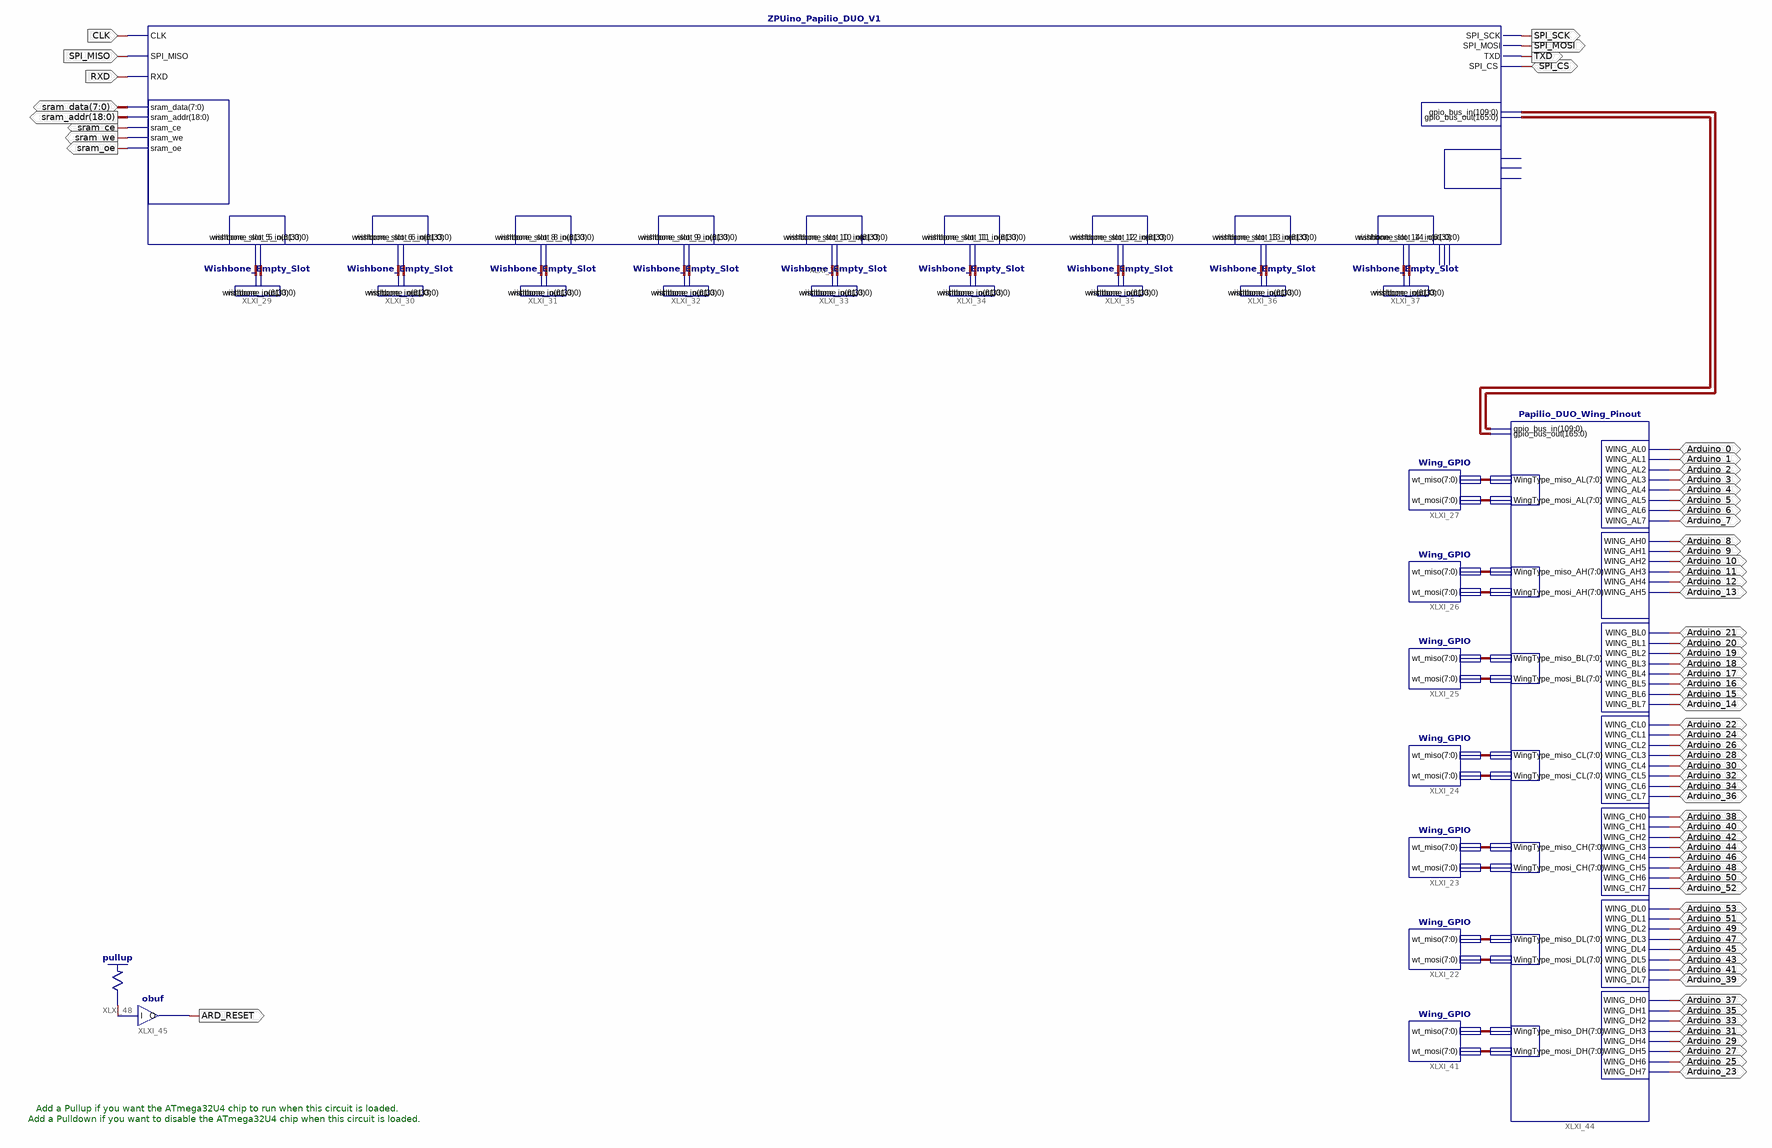
[diagram p0: schematic sheet 1]
// Xilinx ISE schematic Papilio_DUO_LX9.sch (spartan6) as structural Verilog: 20 symbols, 67 ports
module Papilio_DUO_LX9 (
  input  RXD,
  input  SPI_MISO,
  input  CLK,
  inout  Arduino_0,
  inout  Arduino_1,
  inout  Arduino_2,
  inout  Arduino_3,
  inout  Arduino_4,
  inout  Arduino_5,
  inout  Arduino_6,
  inout  Arduino_7,
  inout  Arduino_8,
  inout  Arduino_9,
  inout  Arduino_10,
  inout  Arduino_11,
  inout  Arduino_12,
  inout  Arduino_13,
  inout  Arduino_21,
  inout  Arduino_20,
  inout  Arduino_19,
  inout  Arduino_18,
  inout  Arduino_17,
  inout  Arduino_16,
  inout  Arduino_15,
  inout  Arduino_14,
  inout  SPI_CS,
  inout  [7:0] sram_data,
  inout  Arduino_22,
  inout  Arduino_24,
  inout  Arduino_26,
  inout  Arduino_28,
  inout  Arduino_30,
  inout  Arduino_32,
  inout  Arduino_34,
  inout  Arduino_36,
  inout  Arduino_38,
  inout  Arduino_40,
  inout  Arduino_42,
  inout  Arduino_44,
  inout  Arduino_46,
  inout  Arduino_48,
  inout  Arduino_50,
  inout  Arduino_52,
  inout  Arduino_39,
  inout  Arduino_41,
  inout  Arduino_43,
  inout  Arduino_45,
  inout  Arduino_47,
  inout  Arduino_49,
  inout  Arduino_51,
  inout  Arduino_53,
  inout  Arduino_37,
  inout  Arduino_35,
  inout  Arduino_33,
  inout  Arduino_31,
  inout  Arduino_29,
  inout  Arduino_27,
  inout  Arduino_25,
  inout  Arduino_23,
  output TXD,
  output SPI_MOSI,
  output SPI_SCK,
  output sram_ce,
  output sram_we,
  output sram_oe,
  output [18:0] sram_addr,
  output ARD_RESET
);

  wire XLXN_457;
  wire [7:0] XLXN_325, XLXN_326, XLXN_327, XLXN_328, XLXN_329, XLXN_330, XLXN_331, XLXN_332, XLXN_333,
       XLXN_334, XLXN_335, XLXN_336, XLXN_448, XLXN_449;
  wire [33:0] XLXN_431, XLXN_433, XLXN_435, XLXN_437, XLXN_439, XLXN_441, XLXN_443, XLXN_445, XLXN_447;
  wire [61:0] XLXN_430, XLXN_432, XLXN_434, XLXN_436, XLXN_438, XLXN_440, XLXN_442, XLXN_444, XLXN_446;
  wire [109:0] XLXN_409;
  wire [165:0] XLXN_408;

  Wishbone_Empty_Slot XLXI_37 (.wishbone_in(XLXN_430), .wishbone_out(XLXN_431));
  Wishbone_Empty_Slot XLXI_36 (.wishbone_in(XLXN_432), .wishbone_out(XLXN_433));
  Wishbone_Empty_Slot XLXI_35 (.wishbone_in(XLXN_434), .wishbone_out(XLXN_435));
  Wishbone_Empty_Slot XLXI_34 (.wishbone_in(XLXN_436), .wishbone_out(XLXN_437));
  Wishbone_Empty_Slot XLXI_33 (.wishbone_in(XLXN_438), .wishbone_out(XLXN_439));
  Wishbone_Empty_Slot XLXI_32 (.wishbone_in(XLXN_440), .wishbone_out(XLXN_441));
  Wishbone_Empty_Slot XLXI_31 (.wishbone_in(XLXN_442), .wishbone_out(XLXN_443));
  Wishbone_Empty_Slot XLXI_30 (.wishbone_in(XLXN_444), .wishbone_out(XLXN_445));
  Wishbone_Empty_Slot XLXI_29 (.wishbone_in(XLXN_446), .wishbone_out(XLXN_447));
  Wing_GPIO XLXI_27 (.wt_miso(XLXN_335), .wt_mosi(XLXN_336));
  Wing_GPIO XLXI_26 (.wt_miso(XLXN_333), .wt_mosi(XLXN_334));
  Wing_GPIO XLXI_25 (.wt_miso(XLXN_331), .wt_mosi(XLXN_332));
  Wing_GPIO XLXI_24 (.wt_miso(XLXN_329), .wt_mosi(XLXN_330));
  Wing_GPIO XLXI_23 (.wt_miso(XLXN_327), .wt_mosi(XLXN_328));
  Wing_GPIO XLXI_22 (.wt_miso(XLXN_325), .wt_mosi(XLXN_326));
  ZPUino_Papilio_DUO_V1 XLXI_39 (
    .gpio_bus_out(XLXN_408), .gpio_bus_in(XLXN_409), .SPI_CS(SPI_CS), .TXD(TXD), .SPI_MOSI(SPI_MOSI),
    .SPI_SCK(SPI_SCK), .sram_data(sram_data), .sram_ce(sram_ce), .sram_we(sram_we), .sram_oe(sram_oe),
    .CLK(CLK), .SPI_MISO(SPI_MISO), .RXD(RXD), .wishbone_slot_5_out(XLXN_447), .wishbone_slot_5_in(XLXN_446),
    .wishbone_slot_6_in(XLXN_444), .wishbone_slot_6_out(XLXN_445), .wishbone_slot_8_in(XLXN_442),
    .wishbone_slot_8_out(XLXN_443), .wishbone_slot_9_in(XLXN_440), .wishbone_slot_9_out(XLXN_441),
    .wishbone_slot_10_in(XLXN_438), .wishbone_slot_10_out(XLXN_439), .wishbone_slot_11_in(XLXN_436),
    .wishbone_slot_11_out(XLXN_437), .wishbone_slot_12_in(XLXN_434), .wishbone_slot_12_out(XLXN_435),
    .wishbone_slot_13_in(XLXN_432), .wishbone_slot_13_out(XLXN_433), .wishbone_slot_14_in(XLXN_430),
    .wishbone_slot_14_out(XLXN_431), .sram_addr(sram_addr));  // open: clk_96Mhz, clk_1Mhz, clk_osc_32Mhz, wishbone_slot_video_in, wishbone_slot_video_out, vgaclkout
  Wing_GPIO XLXI_41 (.wt_miso(XLXN_448), .wt_mosi(XLXN_449));
  Papilio_DUO_Wing_Pinout XLXI_44 (
    .WING_AH0(Arduino_8), .WING_AH1(Arduino_9), .WING_AH2(Arduino_10), .WING_AH3(Arduino_11),
    .WING_AH4(Arduino_12), .WING_AH5(Arduino_13), .WING_AL0(Arduino_0), .WING_AL1(Arduino_1),
    .WING_AL2(Arduino_2), .WING_AL3(Arduino_3), .WING_AL4(Arduino_4), .WING_AL5(Arduino_5),
    .WING_BL0(Arduino_21), .WING_BL1(Arduino_20), .WING_BL2(Arduino_19), .WING_BL3(Arduino_18),
    .WING_BL4(Arduino_17), .WING_BL5(Arduino_16), .WING_BL6(Arduino_15), .WING_BL7(Arduino_14),
    .gpio_bus_out(XLXN_408), .gpio_bus_in(XLXN_409), .WingType_miso_BL(XLXN_331),
    .WingType_miso_AH(XLXN_333), .WingType_mosi_BL(XLXN_332), .WingType_mosi_AH(XLXN_334),
    .WingType_mosi_AL(XLXN_336), .WingType_miso_AL(XLXN_335), .WING_CL0(Arduino_22), .WING_CL1(Arduino_24),
    .WING_CL2(Arduino_26), .WING_CL3(Arduino_28), .WING_CL4(Arduino_30), .WING_CL5(Arduino_32),
    .WING_CL6(Arduino_34), .WING_CL7(Arduino_36), .WING_CH0(Arduino_38), .WING_CH1(Arduino_40),
    .WING_CH2(Arduino_42), .WING_CH3(Arduino_44), .WING_CH4(Arduino_46), .WING_CH5(Arduino_48),
    .WING_CH6(Arduino_50), .WING_CH7(Arduino_52), .WingType_mosi_CL(XLXN_330), .WingType_miso_CL(XLXN_329),
    .WingType_miso_CH(XLXN_327), .WingType_mosi_CH(XLXN_328), .WING_DL0(Arduino_53), .WING_DL1(Arduino_51),
    .WING_DL2(Arduino_49), .WING_DL3(Arduino_47), .WING_DL4(Arduino_45), .WING_DL5(Arduino_43),
    .WING_DL6(Arduino_41), .WING_DL7(Arduino_39), .WING_DH0(Arduino_37), .WING_DH1(Arduino_35),
    .WING_DH2(Arduino_33), .WING_DH3(Arduino_31), .WING_DH4(Arduino_29), .WING_DH5(Arduino_27),
    .WING_DH6(Arduino_25), .WING_DH7(Arduino_23), .WingType_mosi_DL(XLXN_326), .WingType_mosi_DH(XLXN_449),
    .WingType_miso_DH(XLXN_448), .WingType_miso_DL(XLXN_325), .WING_AL7(Arduino_7), .WING_AL6(Arduino_6));
  obuf XLXI_45 (.I(XLXN_457), .O(ARD_RESET));
  \pullup  XLXI_48 (.O(XLXN_457));

  // Notes on the sheet:
  //   Add a Pullup if you want the ATmega32U4 chip to run when this circuit is loaded.
  //   Add a Pulldown if you want to disable the ATmega32U4 chip when this circuit is loaded.
endmodule
